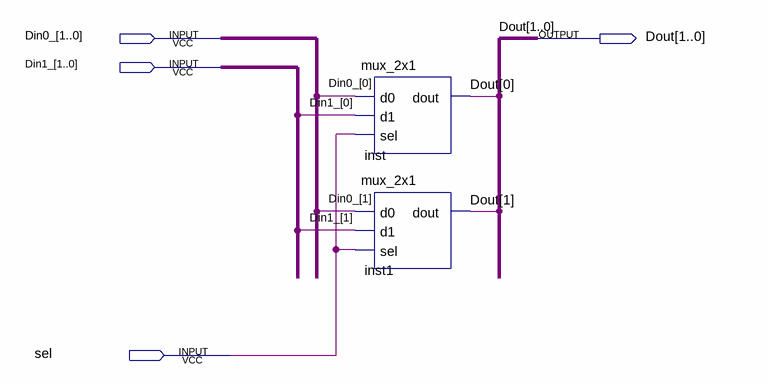
[diagram p0: schematic sheet]
// Quartus schematic mux_2x1_2bit.bdf as structural Verilog: 2 symbols, 4 pins
module mux_2x1_2bit (
  input  [1:0] Din0_,
  input  [1:0] Din1_,
  input  sel,
  output [1:0] Dout
);

  mux_2x1 inst (.d0(Din0_[0]), .d1(Din1_[0]), .sel(sel), .dout(Dout[0]));
  mux_2x1 inst1 (.d0(Din0_[1]), .d1(Din1_[1]), .sel(sel), .dout(Dout[1]));
endmodule
